# Altium schematic sheet Servos.SchDoc
size A
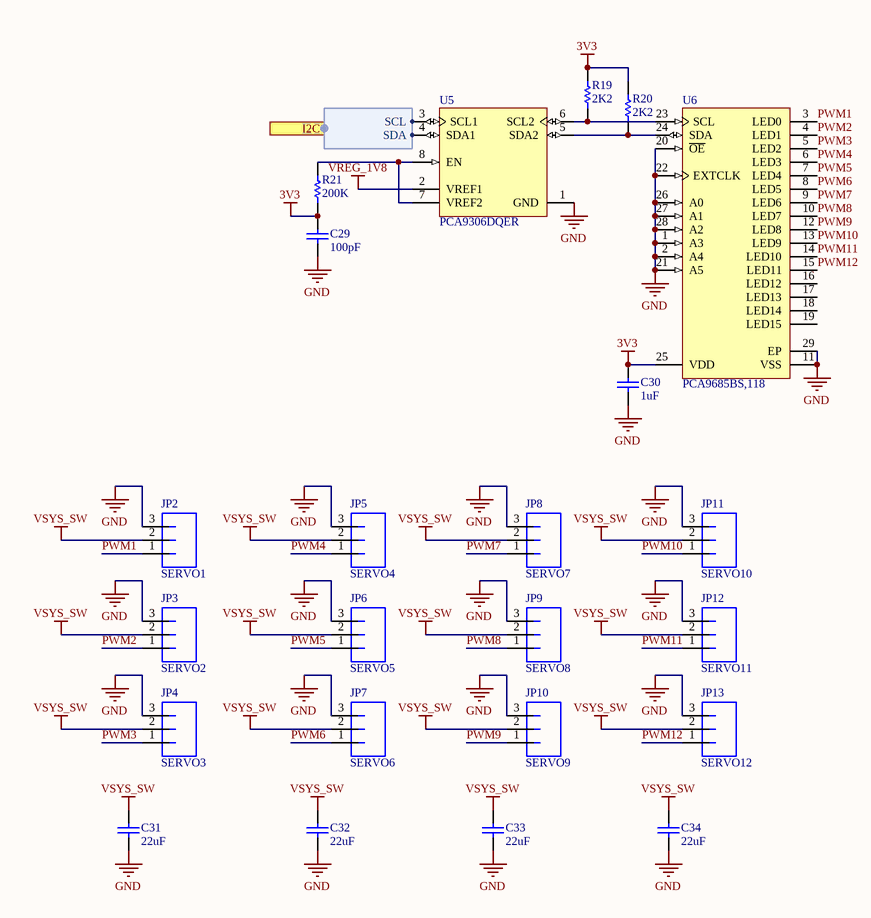
[diagram p0: Servos.SchDoc]

## Parts
C29  value 100pF  [C0402[1005X55]]  (hidden comment: 100pF 100V 0402)
C30  value 1uF  [C0402[1005X55]]  (hidden comment: 1uF 6.3V 0402)
C31  value 22uF  [C0603[1608X92]]  (hidden comment: 22uF 6.3V 0603)
C32  value 22uF  [C0603[1608X92]]  (hidden comment: 22uF 6.3V 0603)
C33  value 22uF  [C0603[1608X92]]  (hidden comment: 22uF 6.3V 0603)
C34  value 22uF  [C0603[1608X92]]  (hidden comment: 22uF 6.3V 0603)
JP2  SERVO1  [MOLEX-PICOBLADE-1.25MM-3-VERT-SMD]
JP3  SERVO2  [MOLEX-PICOBLADE-1.25MM-3-VERT-SMD]
JP4  SERVO3  [MOLEX-PICOBLADE-1.25MM-3-VERT-SMD]
JP5  SERVO4  [MOLEX-PICOBLADE-1.25MM-3-VERT-SMD]
JP6  SERVO5  [MOLEX-PICOBLADE-1.25MM-3-VERT-SMD]
JP7  SERVO6  [MOLEX-PICOBLADE-1.25MM-3-VERT-SMD]
JP8  SERVO7  [MOLEX-PICOBLADE-1.25MM-3-VERT-SMD]
JP9  SERVO8  [MOLEX-PICOBLADE-1.25MM-3-VERT-SMD]
JP10  SERVO9  [MOLEX-PICOBLADE-1.25MM-3-VERT-SMD]
JP11  SERVO10  [MOLEX-PICOBLADE-1.25MM-3-VERT-SMD]
JP12  SERVO11  [MOLEX-PICOBLADE-1.25MM-3-VERT-SMD]
JP13  SERVO12  [MOLEX-PICOBLADE-1.25MM-3-VERT-SMD]
R19  value 2K2  [R0402[1005]]  (hidden comment: 2K2 1% 0402)
R20  value 2K2  [R0402[1005]]  (hidden comment: 2K2 1% 0402)
R21  value 200K  [R0402[1005]]  (hidden comment: 200K 1% 0402)
U5  PCA9306DQER  [DQE0008A_V]
U6  PCA9685BS,118  [VQFN-28]

## Ports
I2C (harness I2C)

## Harnesses
I2C: SCL, SDA

## Nets
3V3: C29.2 C30.2 R19.2 R20.2 R21.1 U6.25(VDD)
GND: C29.1 C30.1 C31.1 C32.1 C33.1 C34.1 JP2.3 JP3.3 JP4.3 JP5.3 JP6.3 JP7.3 JP8.3 JP9.3 JP10.3 JP11.3 JP12.3 JP13.3 U5.1(GND) U6.1(A3) U6.2(A4) U6.11(VSS) U6.20(~{OE}) U6.21(A5) U6.22(EXTCLK) U6.26(A0) U6.27(A1) U6.28(A2) U6.29(EP)
VREG_1V8: U5.2(VREF1)
VSYS_SW: C31.2 C32.2 C33.2 C34.2 JP2.2 JP3.2 JP4.2 JP5.2 JP6.2 JP7.2 JP8.2 JP9.2 JP10.2 JP11.2 JP12.2 JP13.2
PWM1: JP2.1 U6.3(LED0)
PWM2: JP3.1 U6.4(LED1)
PWM3: JP4.1 U6.5(LED2)
PWM4: JP5.1 U6.6(LED3)
PWM5: JP6.1 U6.7(LED4)
PWM6: JP7.1 U6.8(LED5)
PWM7: JP8.1 U6.9(LED6)
PWM8: JP9.1 U6.10(LED7)
PWM9: JP10.1 U6.12(LED8)
PWM10: JP11.1 U6.13(LED9)
PWM11: JP12.1 U6.14(LED10)
PWM12: JP13.1 U6.15(LED11)
NetR19_1: R19.1 U5.6(SCL2) U6.23(SCL)
NetR20_1: R20.1 U5.5(SDA2) U6.24(SDA)
NetR21_2: R21.2 U5.7(VREF2) U5.8(EN)
NetU5_3: U5.3(SCL1) ; port I2C.SCL
NetU5_4: U5.4(SDA1) ; port I2C.SDA

Not connected (* = marked no-connect by the designer): U6 16(LED12) 17(LED13) 18(LED14) 19(LED15)

## Library data of the parts
C29 = CAP_100pF_100V_0402_5%: 100pF 100V 5% 0402 (1005 Metric); PartNumber: GRM1555C2A101JA01D; Manufacturer: Murata; Mounting Technology: Surface Mount; PackageReference: 0402; PackageDescription: 0402 (1005 Metric); Voltage: 100V; Tolerance: 5%
C30 = CAP_1uF_6.3V_0402_10%: 1uF 6.3V 10% 0402 (1005 Metric); PartNumber: GRM155R70J105KA12D; Manufacturer: Murata; Mounting Technology: Surface Mount; PackageReference: 0402; PackageDescription: 0402 (1005 Metric); Voltage: 6.3V; Tolerance: 10%
C31-C34 = CAP_22uF_6.3V_0603_10%: 22uF 6.3V 10% 0603 (1608 Metric); PartNumber: GRT188R60J226ME13D; Manufacturer: Murata; Mounting Technology: Surface Mount; PackageReference: 0603; PackageDescription: 0603 (1608 Metric); Voltage: 6.3V; Tolerance: 10%
JP2-JP13 = MOLEX_PICOBLADE_1.25MM_3_VERT_SMD: Manufacturer: Molex; PartNumber: 0533980371; Mounting Technology: Surface Mount; PackageReference: PicoBlade-1.25mm
R19 R20 = RES_2K2_0402_1%: 2K2 0.063W 1% 0402 (1005 Metric); Manufacturer: KOA Speer; PartNumber: RK73H1ETTP2201F; Tolerance: 1%; Power: 0.063W; Mounting Technology: Surface Mount; PackageReference: 0402; PackageDescription: 0402 (1005 Metric); ComponentLink1Description: Datasheet; ComponentLink1URL: http://www.koaspeer.com/catimages/Products/RK73H/RK73H.pdf
R21 = RES_200K_0402_1%: 200K 0.063W 1% 0402 (1005 Metric); Manufacturer: KOA Speer; PartNumber: RK73H1ETTP2003F; Tolerance: 1%; Power: 0.063W; Mounting Technology: Surface Mount; PackageReference: 0402; PackageDescription: 0402 (1005 Metric); ComponentLink1Description: Datasheet; ComponentLink1URL: http://www.koaspeer.com/catimages/Products/RK73H/RK73H.pdf
U5 = CMP-0314-00177-2: Dual Bi-Directional I2C-Bus and SMBus Voltage Level-Translator, 0 to 5.5 V, -40 to 85 degC, 8-pin X2SON (DQE), Green (RoHS & no Sb/Br); Manufacturer: Texas Instruments; Max Frequency(kHz): 400; tpd max(ns): 1.5; SubFamily: I2C Special Function; Open Drain I/O Type: Yes; Vcc range(V): 0 to 5.5; No. of Outputs: 2; Function: Voltage Translator; Rating: Catalog; PackageVersion: revB, Oct-2008; Eco-Plan: Green (RoHS & no Sb/Br); Mounting Technology: Surface Mount; PackageReference: DQE0008A; ComponentLink1Description: Datasheet; DatasheetVersion: SCPS113J; PartNumber: PCA9306DQER; ComponentLink2Description: Package Specification; fSCLK(Max)(MHz): 400; On-Chip Power-on-Reset: No; Enable Pin: Yes; Code_JEDEC: MO-287-X2EAF; 5V Tolerant I/O: Yes; PackageDescription: 8-Pin Plastic Small Outline No-Lead, 1.4 x 1 x 0.4 mm Body, 0.35 mm Pitch; ComponentLink2URL: http://www.ti.com/litv/pdf/mpds049b; ComponentLink1URL: http://www.ti.com/general/docs/lit/getliterature.tsp?genericPartNumber=PCA9306&fileType=pdf
U6 = PCA9685BS,118: IC LED DRVR LIN DIM 25MA 28HVQFN; Manufacturer: NXP; PartNumber: PCA9685BS,118; PackageReference: QFN-28; Mounting Technology: Surface Mount